# EAGLE design untitled (EAGLE 5.11)
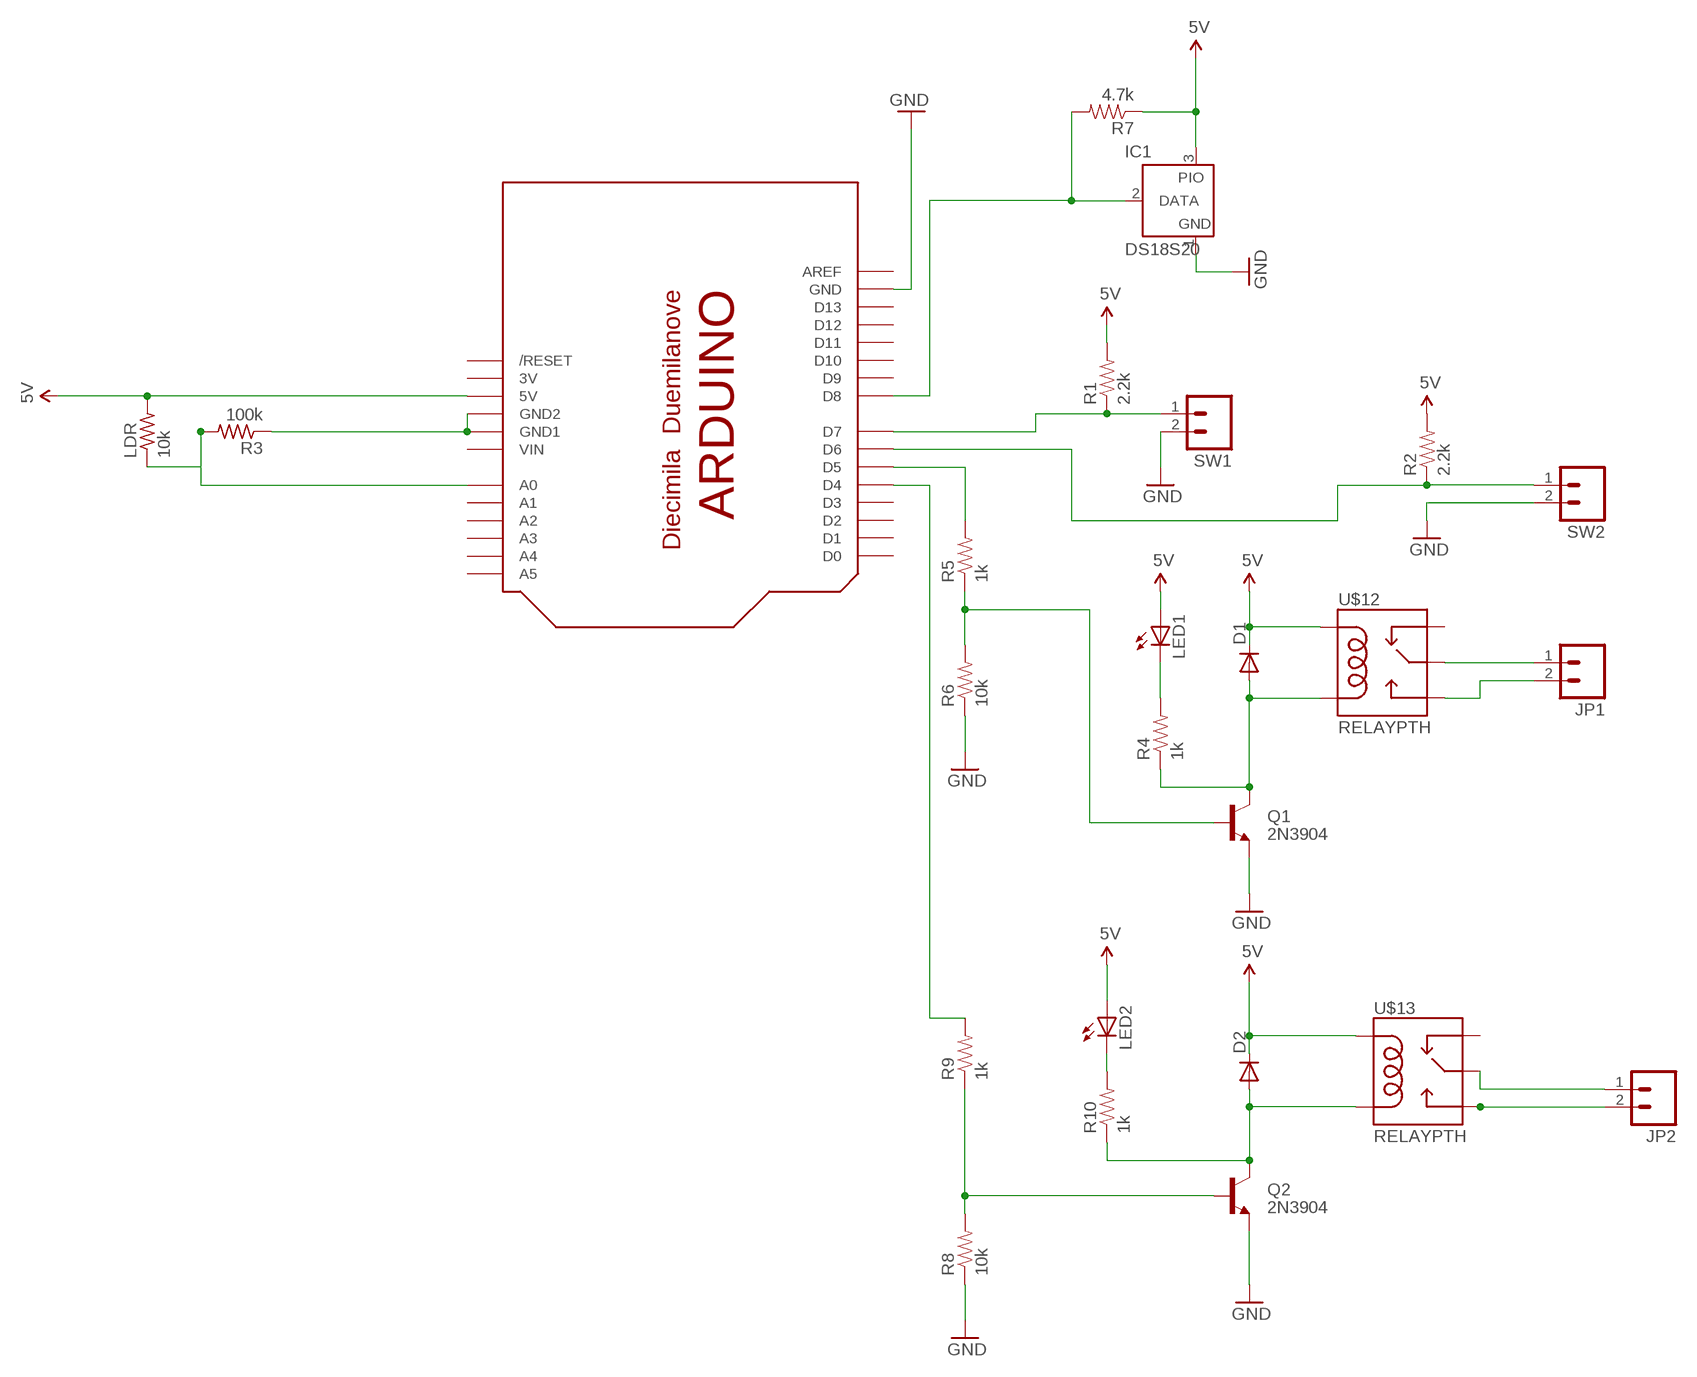
[diagram p0: schematic, sheet 1]

## Parts
D1  DIODE1N4148  [DIODE-1N4148]
D2  DIODE1N4148  [DIODE-1N4148]
IC1  DS18S20  DS2405  [TO92-]
JP1  M02  [1X02_LONGPADS]
JP2  M02  [1X02_LONGPADS]
LDR  10k  R-US_0309/V  [0309V]
LED1  LED5MM  [LED5MM]
LED2  LED5MM  [LED5MM]
Q1  2N3904  TRANSISTOR_NPNTO92  [TO-92]
Q2  2N3904  TRANSISTOR_NPNTO92  [TO-92]
R1  2.2k  RESISTORPTH-1/6W  [1/6W-RES]
R2  2.2k  RESISTORPTH-1/6W  [1/6W-RES]
R3  100k  R-US_0309/V  [0309V]
R4  1k  RESISTORPTH-1/6W  [1/6W-RES]
R5  1k  RESISTORPTH-1/6W  [1/6W-RES]
R6  10k  RESISTORPTH-1/6W  [1/6W-RES]
R7  4.7k  RESISTORPTH-1/6W  [1/6W-RES]
R8  10k  RESISTORPTH-1/6W  [1/6W-RES]
R9  1k  RESISTORPTH-1/6W  [1/6W-RES]
R10  1k  RESISTORPTH-1/6W  [1/6W-RES]
SW1  M02  [1X02_LONGPADS]
SW2  M02  [1X02_LONGPADS]
U$1  ARDUINO-NOHOLE  [ARDUINO-NOHOLE]
U$12  RELAYPTH  [RELAY-G5Q]
U$13  RELAYPTH  [RELAY-G5Q]

## Nets
5V: D1.C D2.C IC1.3(PIO) LDR.2 LED1.A LED2.A R1.2 R2.2 R7.1 U$1.5V U$12.5(COIL1) U$13.5(COIL1)
GND: IC1.1(GND) Q1.1(E) Q2.1(E) R3.1 R6.1 R8.1 SW1.2 SW2.2 U$1.GND U$1.GND1 U$1.GND2
N$1: IC1.2(DATA) R7.2 U$1.D8
N$2: R1.1 SW1.1 U$1.D7
N$3: LDR.1 R3.2 U$1.A0
N$5: R2.1 SW2.1 U$1.D6
N$6: D1.A Q1.3(C) R4.1 U$12.1(COIL2)
N$7: LED1.K(C) R4.2
N$8: Q2.2(B) R8.2 R9.1
N$9: R5.2 U$1.D5
N$10: Q1.2(B) R5.1 R6.2
N$11: JP1.1 U$12.2(MAIN)
N$12: JP1.2 U$12.3(NO)
N$13: R9.2 U$1.D4
N$14: LED2.K(C) R10.2
N$15: JP2.2 U$13.3(NO)
N$16: JP2.1 U$13.2(MAIN)
N$18: D2.A Q2.3(C) R10.1 U$13.1(COIL2)
Unconnected: U$1.A1 U$1.A2 U$1.A3 U$1.A4 U$1.A5 U$1.AREF U$1.D0 U$1.D1 U$1.D2 U$1.D3 U$1.D9 U$1.D10 U$1.D11 U$1.D12 U$1.D13 U$1.RESET(/RESET) U$12.4(NC) U$13.4(NC)

## Power pins joined to a net without a drawn wire
3V: U$1.3V
VIN: U$1.VIN

## Library data of the parts
D1 D2 = SparkFun:DIODE: Diode These are standard reverse protection diodes and small signal diodes. SMA package can handle up to about 1A. SOD-323 can handle about 200mA. What the SOD-323 package when ordering, there are some mfgs out there that are 5-pin packages.
IC1 = maxim:DS2405: Addressable Switch DALLAS Semiconductor; MF: DALLAS SEMICONDUCTOR; MPN: DS2405; OC_FARNELL: 1188025; OC_NEWARK: 06F4645
JP1 JP2 SW1 SW2 = SparkFun:M02: Header 2 Standard 2-pin 0.1" header. Use with straight break away headers (SKU : PRT-00116), right angle break away headers (PRT-00553), swiss pins (PRT-00743), machine pins (PRT-00117), and female headers (PRT-00115). Molex polarized connector foot print use with SKU : PRT-08233 with associated crimp pins and housings.
LDR R3 = adafruit:R-US_: RESISTOR, American symbol
LED1 LED2 = SparkFun:LED: LEDs Standard schematic elements and footprints for 5mm, 3mm, 1206, and 0603 sized LEDs. 5mm - Spark Fun Electronics SKU : COM-00529 (and others)
Q1 Q2 = SparkFun:TRANSISTOR_NPN: Transistor NPN BJT configuration in SOT23 package. MMBT2222 is the common NPN we use. Double check BCE configuration again layout.
R1 R2 R4-R10 = SparkFun:RESISTOR: Resistor Basic schematic elements and footprints for 0603, 1206, and PTH 1/10th watt (small) resistors.
U$1 = adafruit:ARDUINO: Arduino Diecimila/Duemilanove Make a shield with ease, this package has all the named pins as well as the two mounting drill holes and an outline of the USB and DC power connector. The outline is on the DIMENSION layer, so if your board house uses it they will cut the outline to match. http://www.ladyada.net/library/pcb/eaglelibrary.html
U$12 U$13 = SparkFun:RELAY

## Board
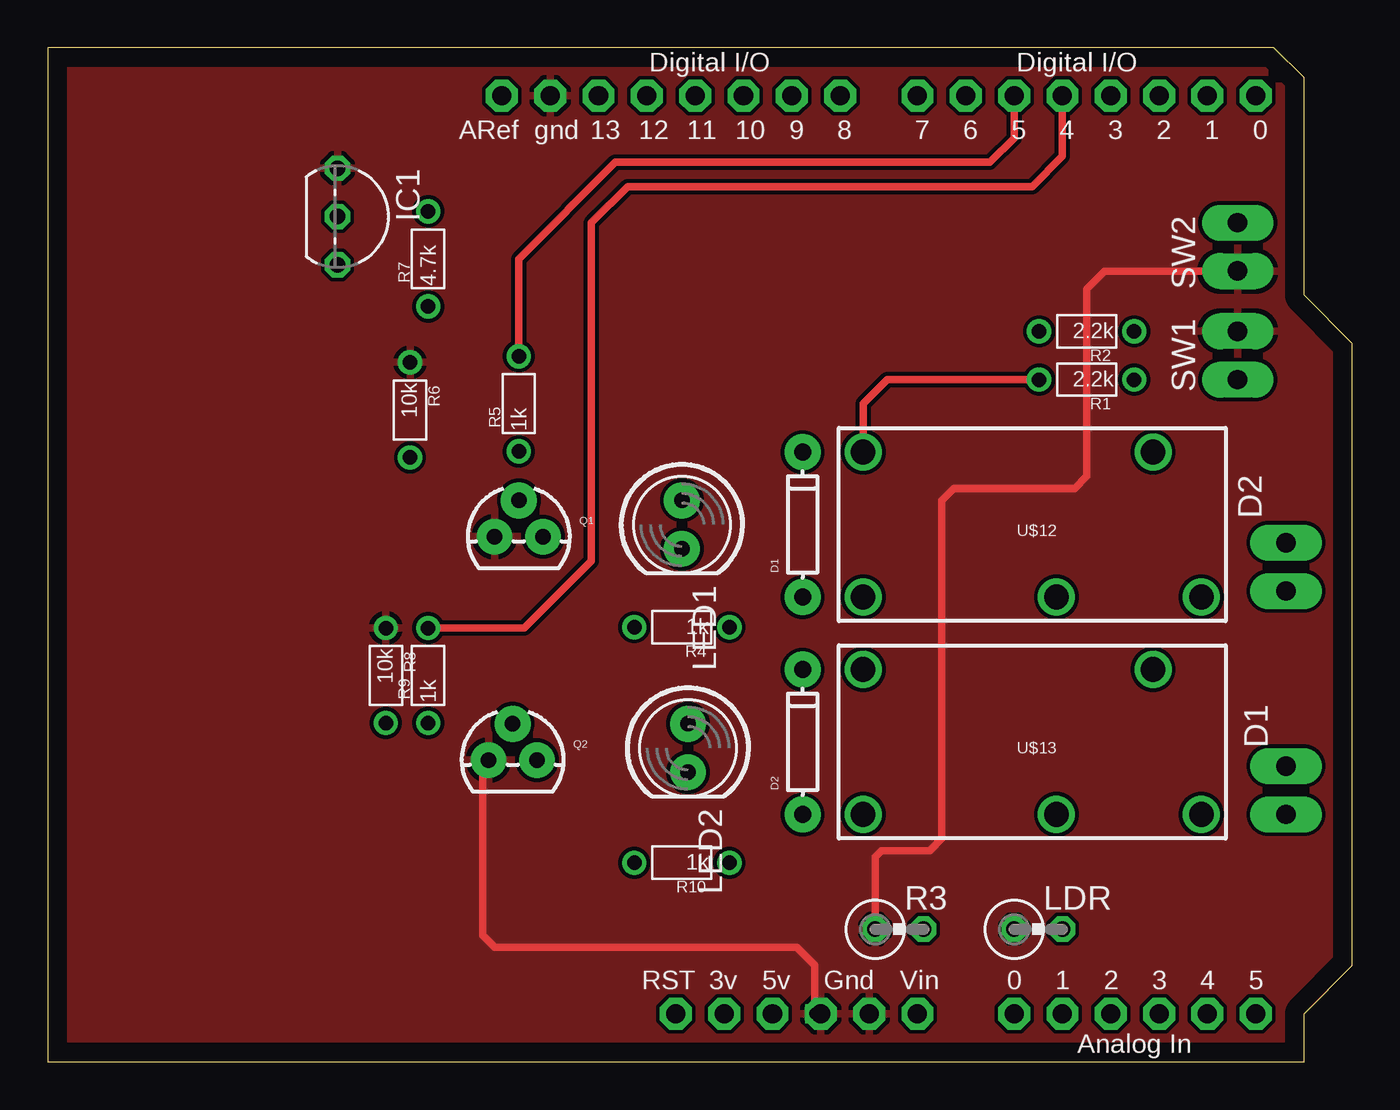
[diagram p1: board, top side]
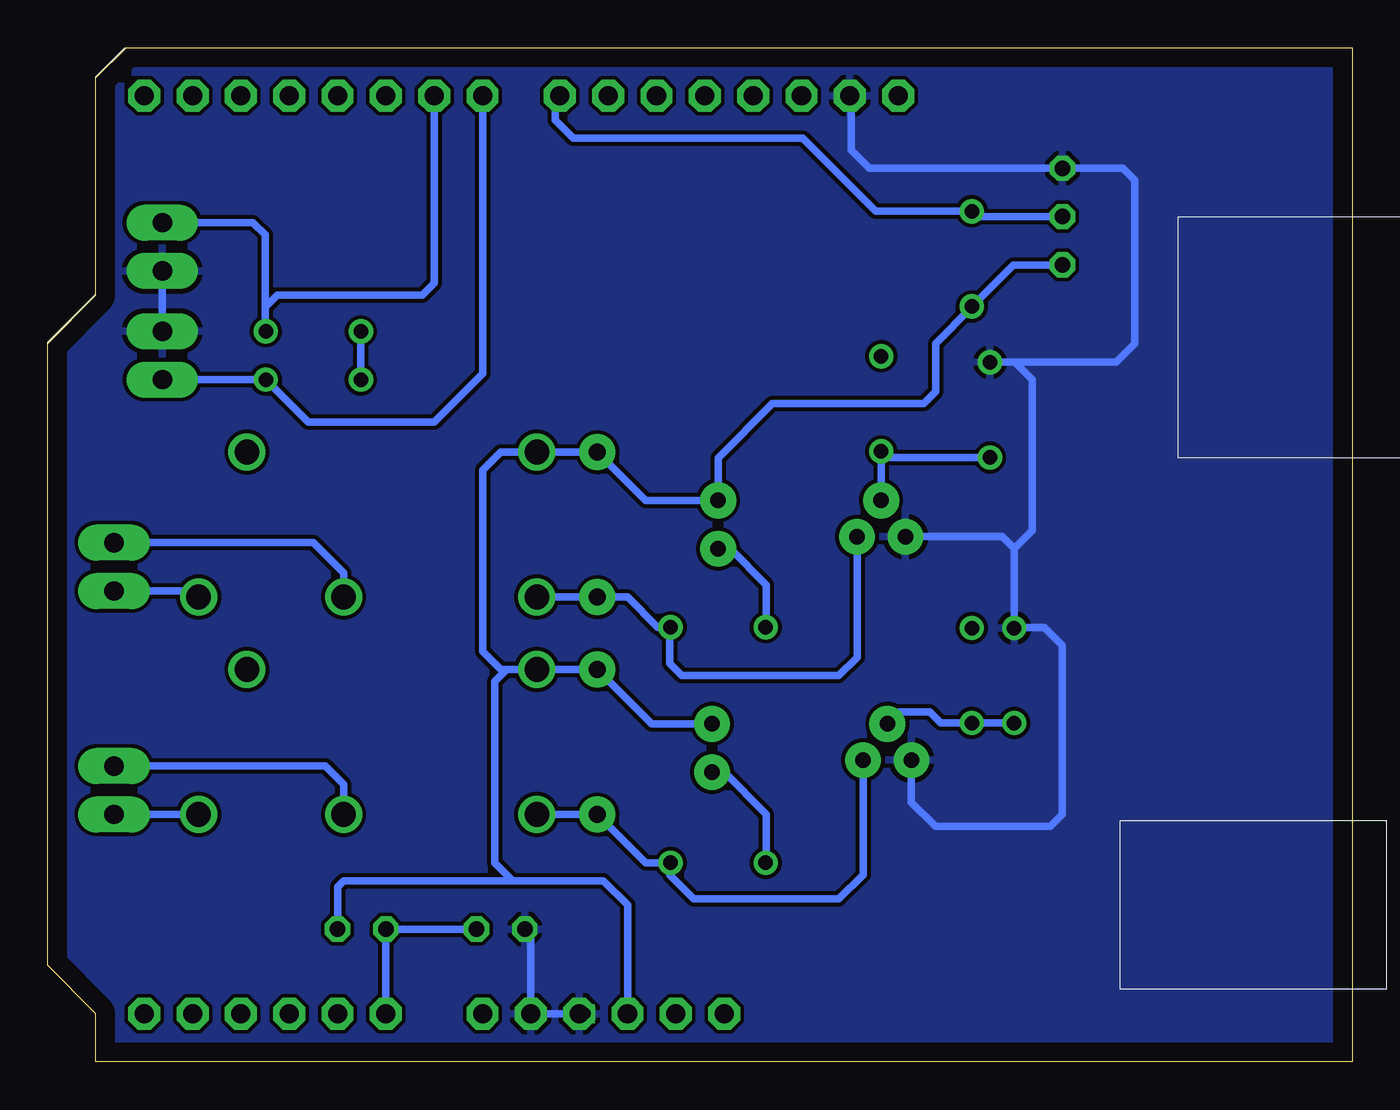
[diagram p2: board, bottom side, seen from below]

Size 68.58 x 53.34 mm. Coordinates in mm from the lower left corner, seen from the top.
Outline: 0,0 66.04,0 66.04,2.54 68.57,5.08 68.58,37.78 66.04,40.31 66.04,51.74 64.45,53.34 0,53.33 0,0
Copper layers (1*16): Top 0.035mm / dielectric 1.5mm / Bottom 0.035mm
Design rules "default": minimum track width 10mil, minimum drill 24mil, track to track 8mil, track to pad 8mil, pad to pad 8mil, via to via 8mil, smd to smd 8mil, copper to edge 40mil, drill to drill 8mil, minimum pad ring 10mil, minimum via ring 8mil, stop-mask expansion 4mil, vias tented up to drill 0mil, thermal gap 10mil

### Footprints (pad centres in the part's own frame; a part is rotated, then mirrored left to right if it is on the bottom)
DIODE-1N4148 = drill 0.9 pad 1.88 round: A -3.81,0; C 3.81,0
TO92- = drill 0.813 octagon: 1 -2.54,0; 2 0,0; 3 2.54,0
1X02_LONGPADS = drill 1.016 pad 1.88 long: 1 0,0; 2 2.54,0
0309V = drill 0.813 octagon: 1 -1.27,0; 2 1.27,0
LED5MM = drill 0.813 pad 1.88 round: A -1.27,0; K 1.27,0
TO-92 = drill 0.813 pad 1.88 round: 1 -1.27,0; 2 0,1.905; 3 1.27,0
1/6W-RES = drill 0.762 round: 1 -2.5,0; 2 2.5,0
ARDUINO-NOHOLE = drill 1 pad 1.676 octagon: 3V 35.56,2.54; 5V 38.1,2.54; A0 50.8,2.54; A1 53.34,2.54; A2 55.88,2.54; A3 58.42,2.54; A4 60.96,2.54; A5 63.5,2.54; AREF 23.876,50.8; D0 63.5,50.8; D1 60.96,50.8; D2 58.42,50.8; D3 55.88,50.8; D4 53.34,50.8; D5 50.8,50.8; D6 48.26,50.8; D7 45.72,50.8; D8 41.656,50.8; D9 39.116,50.8; D10 36.576,50.8; D11 34.036,50.8; D12 31.496,50.8; D13 28.956,50.8; GND 26.416,50.8; GND1 43.18,2.54; GND2 40.64,2.54; RESET 33.02,2.54; VIN 45.72,2.54
RELAY-G5Q = drill 1.3 round: 1 8.89,3.81; 2 -1.27,3.81; 3 -8.89,3.81; 4 -6.35,-3.81; 5 8.89,-3.81

### Placement (x,y rotation side)
D1  39.69,28.26 90 top
D2  39.69,16.83 90 top
IC1  15.24,44.45 270 top
JP1  65.09,27.3 270 top
JP2  65.09,15.56 270 top
LDR  52.07,6.99 0 top
LED1  33.34,28.26 270 top
LED2  33.66,16.51 270 top
Q1  24.77,27.62 0 top
Q2  24.45,15.88 0 top
R1  54.61,35.88 180 top
R2  54.61,38.42 180 top
R3  44.77,6.99 0 top
R4  33.34,22.86 180 top
R5  24.77,34.61 90 top
R6  19.05,34.29 270 top
R7  20,42.23 90 top
R8  17.78,20.32 270 top
R9  20,20.32 90 top
R10  33.34,10.48 180 top
SW1  62.55,35.88 90 top
SW2  62.55,44.13 270 top
U$1  0,0 0 top
U$12  51.75,28.26 180 top
U$13  51.75,16.83 180 top

### Tracks (layer width: path | path; a pad name or v marks a point on that pad's centre or on a via)
5V
  Top 0.406: R1.2 44.13,35.88 42.86,34.61 U$12.5
  Bottom 0.406: IC1.3 17.82,41.91 R7.1 20,39.69 21.91,37.78 21.91,35.24 22.54,34.61 30.48,34.61 33.34,31.75 LED1.A 37.15,29.53 D1.C U$12.5 44.77,32.07 45.72,31.11 45.72,21.59 44.77,20.64 44.45,20.64 | U$1.5V 38.1,8.26 39.37,9.53 44.13,9.53 | LED2.A 36.83,17.78 D2.C U$13.5 44.45,20.64 | R1.2 R2.2 | LDR.2 53.34,9.21 53.02,9.53 44.13,9.53 | 44.13,9.53 45.09,10.48 45.09,20 44.45,20.64
GND  (via drill 0.6)
  Top 0.406: SW2.2 55.56,41.59 54.61,40.64 54.61,30.8 53.98,30.16 47.62,30.16 46.99,29.53 46.99,11.75 46.35,11.11 43.81,11.11 43.5,10.79 R3.1 | v40.32,2.54 40.32,5.08 39.37,6.03 23.5,6.03 22.86,6.67 22.86,15.56 Q2.1
  Bottom 0.406: U$1.GND 26.35,50.74 26.35,47.94 25.4,46.99 IC1.1 12.06,46.99 11.43,46.35 11.43,37.78 12.42,36.79 R6.1 17.74,36.79 16.83,35.88 16.83,27.94 17.78,26.99 | R3.1 43.18,6.67 U$1.GND1 U$1.GND2 v40.32,2.54 | 17.78,26.99 R8.1 17.74,22.86 16.19,22.86 15.24,21.91 15.24,13.02 15.88,12.38 21.91,12.38 23.18,13.65 Q2.1 | 17.78,26.99 18.41,27.62 Q1.1 | SW2.2 SW1.2
  pour Top: 0,53.34 0,0 66.04,0 66.04,2.54 68.58,5.08 68.58,38.1 66.04,40.64 66.04,52.07 65.72,52.07 64.45,53.34
  pour Bottom: 0,53.34 64.45,53.34 66.04,51.75 66.04,40.64 68.58,38.1 68.58,5.08 66.04,2.54 66.04,0 0,0
N$1
  Bottom 0.406: IC1.2 19.73,44.45 R7.2 25.04,44.73 28.89,48.58 40.96,48.58 41.91,49.53 41.91,50.55 U$1.D8
N$2
  Bottom 0.406: U$1.D7 45.72,36.2 48.26,33.66 54.89,33.66 R1.1 SW1.1
N$3
  Bottom 0.406: R3.2 LDR.1 U$1.A0
N$5
  Bottom 0.406: SW2.1 57.78,44.13 57.15,43.5 57.15,39.69 | 57.15,39.69 57.15,38.46 R2.1 | U$1.D6 48.26,40.96 48.9,40.32 56.52,40.32 57.15,39.69
N$6
  Bottom 0.406: Q1.3 26.04,21.27 26.99,20.32 35.24,20.32 35.88,20.95 35.88,22.82 R4.1 36.51,22.86 38.1,24.45 D1.A U$12.1
N$7
  Bottom 0.406: LED1.K 32.7,26.99 30.8,25.08 30.8,22.9 R4.2
N$8
  Bottom 0.406: R8.2 R9.1 21.63,17.82 22.23,18.41 23.81,18.41 Q2.2
N$9
  Top 0.406: R5.2 24.77,42.23 29.84,47.31 49.53,47.31 50.8,48.58 U$1.D5
N$10
  Bottom 0.406: R6.2 24.45,31.79 R5.1 Q1.2
N$11
  Bottom 0.406: U$12.2 53.02,25.72 54.61,27.3 JP1.1
N$12
  Bottom 0.406: JP1.2 60.96,24.77 U$12.3
N$13
  Top 0.406: R9.2 25.04,22.82 28.57,26.35 28.57,44.13 30.48,46.04 51.75,46.04 53.34,47.62 U$1.D4
N$14
  Bottom 0.406: LED2.K 33.02,15.24 30.8,13.02 30.8,10.52 R10.2
N$15
  Bottom 0.406: U$13.3 JP2.2
N$16
  Bottom 0.406: JP2.1 53.98,15.56 53.02,14.61 U$13.2
N$18
  Bottom 0.406: Q2.3 25.72,9.84 26.99,8.57 34.61,8.57 35.88,9.84 35.88,10.44 R10.1 37.15,10.48 D2.A U$13.1

### Text on the board
tNames: SW2 | SW1 | D2 | D1